# Altium project SL6243A.PrjPcb
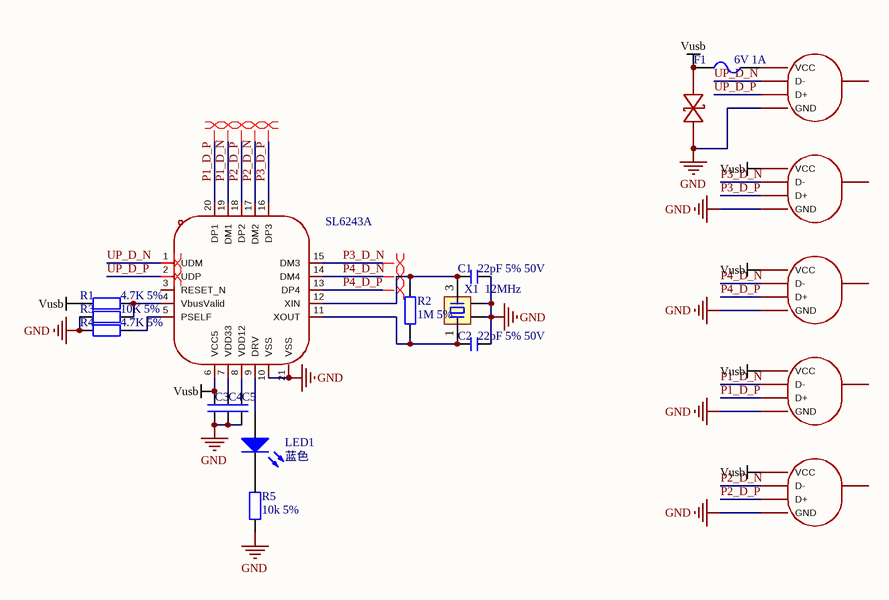
[diagram p0: SL6243A.SchDoc]
1 sheet, 20 parts. Net scope: global (net labels, ports and power ports of the same name join across sheets).
Board file: SL6243A.PcbDoc

## Sheet SL6243A.SchDoc
size A4; SheetNumber: 1; SheetTotal: 1

### Parts
C1  22pF 5% 50V  [C0603_L]
C2  22pF 5% 50V  [C0603_L]
C3  4.7uF 10% 16V  [C0603_L]  (value not drawn)
C4  4.7uF 10% 16V  [C0603_L]  (value not drawn)
C5  4.7uF 10% 16V  [C0603_L]  (value not drawn)
D1  smfj6.0ca_c151891  [SOD-123FL_L2.8-W1.8-LS3.7-BI]  (value not drawn)
F1  6V 1A  [F0805]
LED1  蓝色  [LED0603-FD]
R1  4.7K 5%  [R0603_L]
R2  1M 5%  [R0603_L]
R3  10K 5%  [R0603_L]
R4  4.7K 5%  [R0603_L]
R5  10k 5%  [R0603_L]
U1  SL6243A  [QFN-20_L3.0-W3.0-P0.40-BL-EP1.7]
USB1  af 180°zjb13.7  [USB-A-TH_AF-ZJB13.7]  (value not drawn)
USB2  af 180°zjb13.7  [USB-A-TH_AF-ZJB13.7]  (value not drawn)
USB3  af 180°zjb13.7  [USB-A-TH_AF-ZJB13.7]  (value not drawn)
USB4  af 180°zjb13.7  [USB-A-TH_AF-ZJB13.7]  (value not drawn)
USB5  af 90° wjdg  [USB-A-TH_AF-WJDG]  (value not drawn)
X1  12MHz  [OSC-3225-4P]

### Nets
GND: C1.1 C2.1 C3.2 C4.2 C5.2 D1.1 R3.2 R4.1 R5.1 U1.10(VSS) U1.21(VSS) USB1.4(GND) USB2.4(GND) USB3.4(GND) USB4.4(GND) USB5.4(GND) X1.2 X1.4
Vusb: C3.1 D1.2 F1.2 R1.1 U1.6(VCC5) USB2.1(VCC) USB3.1(VCC) USB4.1(VCC) USB5.1(VCC)
P1_D_N: U1.19(DM1) USB4.2(D-)
P1_D_P: U1.20(DP1) USB4.3(D+)
P2_D_N: U1.17(DM2) USB5.2(D-)
P2_D_P: U1.18(DP2) USB5.3(D+)
P3_D_N: U1.15(DM3) USB2.2(D-)
P3_D_P: U1.16(DP3) USB2.3(D+)
P4_D_N: U1.14(DM4) USB3.2(D-)
P4_D_P: U1.13(DP4) USB3.3(D+)
UP_D_N: U1.1(UDM) USB1.2(D-)
UP_D_P: U1.2(UDP) USB1.3(D+)
NetC1_2: C1.2 R2.1 U1.12(XIN) X1.3
NetC2_2: C2.2 R2.2 U1.11(XOUT) X1.1
NetC4_1: C4.1 U1.7(VDD33)
NetC5_1: C5.1 U1.8(VDD12)
NetF1_1: F1.1 USB1.1(VCC)
NetLED1_1: LED1.1(A) U1.9(DRV)
NetLED1_2: LED1.2(K) R5.2
NetR1_2: R1.2 R3.1 U1.4(VbusValid)
NetR4_2: R4.2 U1.5(PSELF)

Not connected (* = marked no-connect by the designer): U1 3(RESET_N); USB1 5(SHLD); USB2 5(SHLD); USB3 5(SHLD); USB4 5(SHLD); USB5 5(SHLD)

### Layout directives
differential pair: P1_D_N, P1_D_P, P2_D_N, P2_D_P, P3_D_N, P3_D_P, P4_D_N, P4_D_P, UP_D_N, UP_D_P

### Library data of the parts
C1-C5 = C: 贴片电容; BOM名称: 无极性贴片电容; 优秀评价可免费更新: 联系淘宝ID：黄晶宝石，获取更新版封装库; 卖家免费技术支持，联系售后: 唯一出售店铺网址https://shop463601444.taobao.com; 本封装库来自淘宝卖家 ID：黄晶宝石: 其他店铺购入均为盗版，请立即申请退款
D1 = smfj6.0ca_c151891: 极性:双向;反向截止电压(Vrwm):6V;钳位电压:10.3V;峰值脉冲电流(Ipp):19.4A@10/1000us;峰值脉冲功率(Ppp):200W@10/1000us;击穿电压:7.37V;; Manufacturer: BORN(伯恩半导体); AddInBom: yes; ModelId: d105299b3871451c86f679efef28ff8f; ModelTransform: 145.669,70.866,0,0,0,0,0,0,0; Polarity: 双向; Reverse Stand-Off Voltage (Vrwm): 6V; Clamping Voltage: 10.3V; Voltage - Breakdown: 7.37V; Reverse Leakage Current (Ir): 100uA; Type: TVS; Symbol: SMFJ6.0CA; LCSC Part Name: 双向TVS 6V截止 峰值浪涌电流：19.4A@10/1000us; SupplierPart: C151891; ManufacturerPart: SMFJ6.0CA; Supplier Footprint: SOD-123FL; JLCPCB Part Class: Extended Part; Datasheet: https://item.szlcsc.com/datasheet/SMFJ6.0CA/163231.html; Supplier: LCSC; ConvertToPcb: yes; FootprintName: SOD-123FL_L2.8-W1.8-LS3.7-BI; ModelName: SOD-123FL_L2.8-W1.8-LS3.7-BI; Peak Pulse Current (Ipp): 19.4A@10/1000us; Peak Pulse Power Dissipation (Ppp): 200W@10/1000us
F1 = FUSE 1808: 0805自恢复保险座; BOM名称: 1808保险座; 当前库版本V2023.10.25 @淘宝卖家:黄晶宝石: 最新版本发布https://item.taobao.com/item.htm?id=566775463719
LED1 = LED: 贴片LED; 封装库来自淘宝卖家：黄晶宝石: 其他店铺购入均为盗版封装库，无更新权益，请立即申请退款，本店现金奖励200~1000元; BOM名称: 贴片LED
R1-R5 = R: 贴片电阻; 优秀评价可免费更新: 联系淘宝ID：黄晶宝石，获取更新版封装库; 卖家免费技术支持，联系售后: 唯一出售店铺网址https://shop463601444.taobao.com; 本封装库来自淘宝卖家 ID：黄晶宝石: 其他店铺购入均为盗版，请立即申请退款; BOM名称: 贴片电阻
USB1-USB4 = af 180°zjb13.7: 连接器类型:Type-A;标准:USB 2.0;公母:母;安装方式:直插;触点数量:4P;端口数量:1;额定电流 - 电源:1.5A;工作温度范围:-25℃~+85℃;; Manufacturer: SHOU HAN(首韩); AddInBom: yes; ModelId: c3dea282a4a445c4ae65c8aa64bfab47; ModelTransform: 562.991,271.653,0,0,0,0,0,3.78,-188.976; Connector Type: Type-A; Gender: 母; Number of Contacts: 4P; Number of Ports: 1; Current Rating - Power (Max): 1.5A; Rated Voltage (Max): 30V; Connect-Disconnect Life: 5千次; Core Colour: 白色; Symbol: AF 180°ZJB13.7; LCSC Part Name: Type-A 母 直插; SupplierPart: C456015; ManufacturerPart: AF 180°ZJB13.7; Supplier Footprint: 插件; JLCPCB Part Class: Extended Part; Datasheet: https://atta.szlcsc.com/upload/public/pdf/source/20241125/3F1287FBF237B0DC4F79F9BB9BA7EB30.pdf; Supplier: LCSC; ConvertToPcb: yes; FootprintName: USB-A-TH_AF-ZJB13.7; ModelName: USB-A-TH_AF-ZJB13.7; Standard: USB 2.0; Mounting Style: 直插; Supplementary Features: -; Center Height: -; Length: 13.7mm; Operating Temperature Range: -25℃~+85℃
USB5 = af 90° wjdg: 连接器类型:Type-A;协议标准:USB 2.0;公母:母;安装方式:弯插;触点数量:4P;端口数量:1;额定电流 - 电源:1.5A;工作温度:-25℃~+85℃;; Manufacturer: SHOU HAN(首韩); AddInBom: yes; ModelId: 268f7f19b8674295a50f5e7a4a3dee80; ModelName: USB-A-TH_4P-L14.5-W14.0-H7.6-S2.71; ModelTransform: 610.19406,551.18,0,0,0,0,0,-192.915,-149.606; Connector Type: Type-A; Protocol Standard: USB 2.0; Gender: 母; Number of Contacts: 4P; Number of Ports: 1; Current Rating-Power: 1.5A; Voltage Rating: 30V; Connect-Disconnect Life: 5千次; Detection color: 白色; Symbol: AF 90° WJDG; LCSC Part Name: Type-A 母 弯插; SupplierPart: C456018; ManufacturerPart: AF 90° WJDG; Supplier Footprint: 弯插; JLCPCB Part Class: Extended Part; Datasheet: https://item.szlcsc.com/datasheet/AF%252090%25C2%25B0%2520WJDG/458825.html; Supplier: LCSC; ConvertToPcb: yes; FootprintName: USB-A-TH_AF-WJDG; Mounting Type: 弯插; Supplementary Features: -; Center Height: -; Length: 14mm; Operating Temperature: -25℃~+85℃
X1 = XTAL-4P: 4脚无源晶振; 版权归属: 封装库来自淘宝卖家 ID：黄晶宝石; 优秀评价可免费更新: 联系淘宝ID：黄晶宝石，获取更新版封装库; 卖家免费技术支持，联系售后: 唯一出售店铺网址https://shop463601444.taobao.com; 封装库来自淘宝卖家 ID：黄晶宝石: 其他店铺购入均为盗版，请立即申请退款; BOM名称: 4脚无源晶振
U1 = SL6243A: Symbol: SL6243A